# Altium schematic sheet [4]_SCH_input.SchDoc
size A
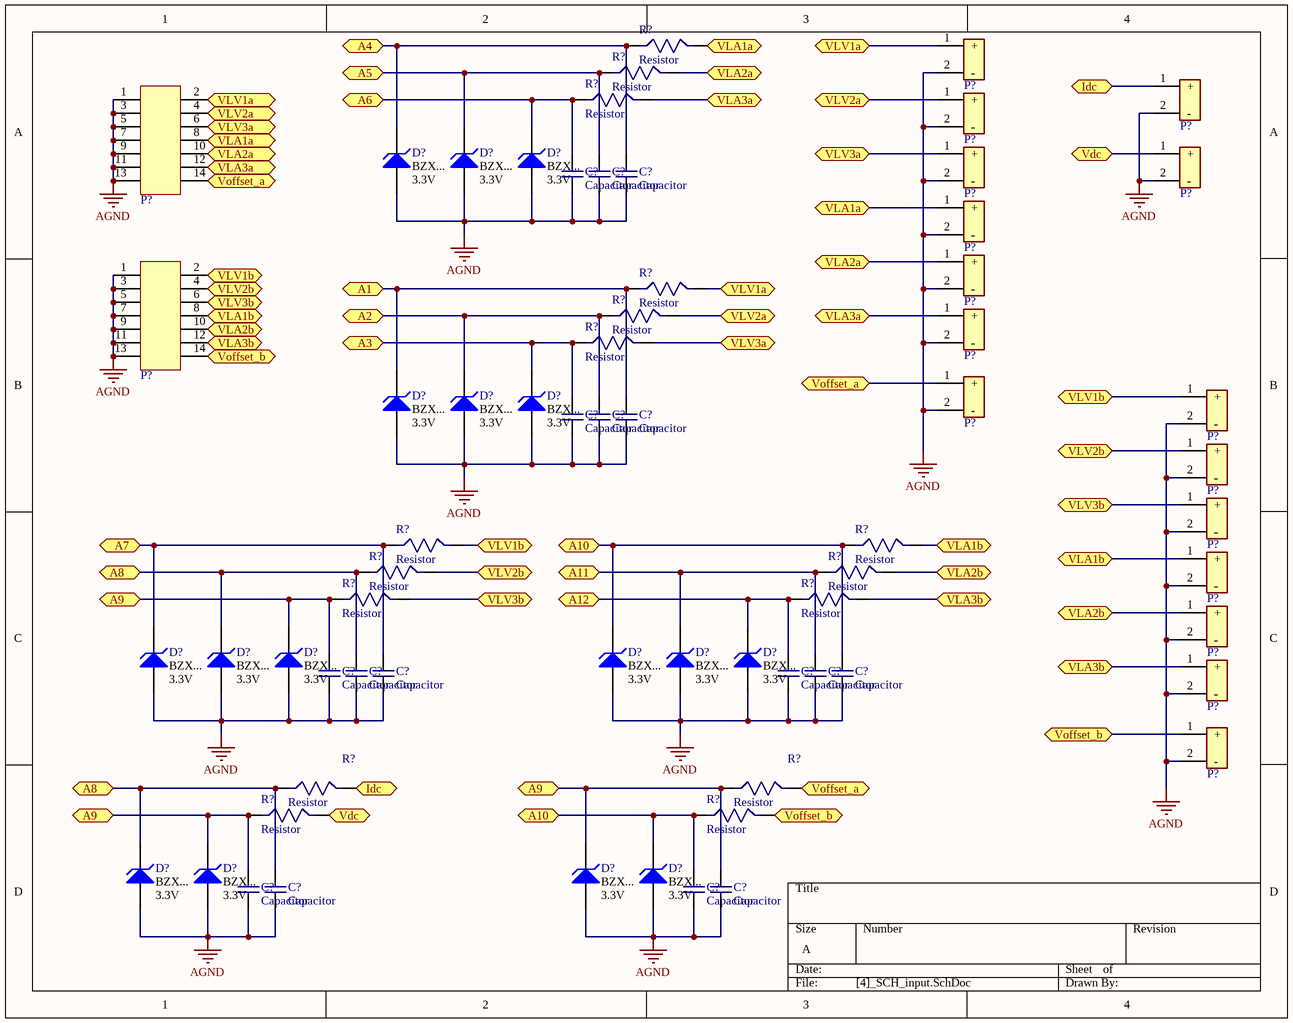
[diagram p0: [4]_SCH_input.SchDoc]

## Parts
(Parts that share a designator on the sheet are numbered #1, #2 ... from top to bottom, then left to right.)
C?#1  Capacitor  [C-NP-0805]
C?#2  Capacitor  [C-NP-0805]
C?#3  Capacitor  [C-NP-0805]
C?#4  Capacitor  [C-NP-0805]
C?#5  Capacitor  [C-NP-0805]
C?#6  Capacitor  [C-NP-0805]
C?#7  Capacitor  [C-NP-0805]
C?#8  Capacitor  [C-NP-0805]
C?#9  Capacitor  [C-NP-0805]
C?#10  Capacitor  [C-NP-0805]
C?#11  Capacitor  [C-NP-0805]
C?#12  Capacitor  [C-NP-0805]
C?#13  Capacitor  [C-NP-0805]
C?#14  Capacitor  [C-NP-0805]
C?#15  Capacitor  [C-NP-0805]
C?#16  Capacitor  [C-NP-0805]
D?#1  value BZX...  Volt: 3.3V  [DO_123]  (hidden comment: Diode Zener)
D?#2  value BZX...  Volt: 3.3V  [DO_123]  (hidden comment: Diode Zener)
D?#3  value BZX...  Volt: 3.3V  [DO_123]  (hidden comment: Diode Zener)
D?#4  value BZX...  Volt: 3.3V  [DO_123]  (hidden comment: Diode Zener)
D?#5  value BZX...  Volt: 3.3V  [DO_123]  (hidden comment: Diode Zener)
D?#6  value BZX...  Volt: 3.3V  [DO_123]  (hidden comment: Diode Zener)
D?#7  value BZX...  Volt: 3.3V  [DO_123]  (hidden comment: Diode Zener)
D?#8  value BZX...  Volt: 3.3V  [DO_123]  (hidden comment: Diode Zener)
D?#9  value BZX...  Volt: 3.3V  [DO_123]  (hidden comment: Diode Zener)
D?#10  value BZX...  Volt: 3.3V  [DO_123]  (hidden comment: Diode Zener)
D?#11  value BZX...  Volt: 3.3V  [DO_123]  (hidden comment: Diode Zener)
D?#12  value BZX...  Volt: 3.3V  [DO_123]  (hidden comment: Diode Zener)
D?#13  value BZX...  Volt: 3.3V  [DO_123]  (hidden comment: Diode Zener)
D?#14  value BZX...  Volt: 3.3V  [DO_123]  (hidden comment: Diode Zener)
D?#15  value BZX...  Volt: 3.3V  [DO_123]  (hidden comment: Diode Zener)
D?#16  value BZX...  Volt: 3.3V  [DO_123]  (hidden comment: Diode Zener)
P?#1  SMA  [SMA]  (value not drawn)
P?#2  SMA  [SMA]  (value not drawn)
P?#3  header_2x7  [hd_2x7]  (value not drawn)
P?#4  SMA  [SMA]  (value not drawn)
P?#5  SMA  [SMA]  (value not drawn)
P?#6  SMA  [SMA]  (value not drawn)
P?#7  SMA  [SMA]  (value not drawn)
P?#8  SMA  [SMA]  (value not drawn)
P?#9  header_2x7  [hd_2x7]  (value not drawn)
P?#10  SMA  [SMA]  (value not drawn)
P?#11  SMA  [SMA]  (value not drawn)
P?#12  SMA  [SMA]  (value not drawn)
P?#13  SMA  [SMA]  (value not drawn)
P?#14  SMA  [SMA]  (value not drawn)
P?#15  SMA  [SMA]  (value not drawn)
P?#16  SMA  [SMA]  (value not drawn)
P?#17  SMA  [SMA]  (value not drawn)
P?#18  SMA  [SMA]  (value not drawn)
R?#1  Resistor  [RESC0805]
R?#2  Resistor  [RESC0805]
R?#3  Resistor  [RESC0805]
R?#4  Resistor  [RESC0805]
R?#5  Resistor  [RESC0805]
R?#6  Resistor  [RESC0805]
R?#7  Resistor  [RESC0805]
R?#8  Resistor  [RESC0805]
R?#9  Resistor  [RESC0805]
R?#10  Resistor  [RESC0805]
R?#11  Resistor  [RESC0805]
R?#12  Resistor  [RESC0805]
R?#13  Resistor  [RESC0805]
R?#14  Resistor  [RESC0805]
R?#15  Resistor  [RESC0805]
R?#16  Resistor  [RESC0805]

## Ports
A1, A2, A3, A4, A5, A6, A7, A8, A9, A10, A11, A12, Idc, Vdc, VLA1a, VLA1b, VLA2a, VLA2b, VLA3a, VLA3b, VLV1a, VLV1b, VLV2a, VLV2b, VLV3a, VLV3b, Voffset_a, Voffset_b

## Nets
AGND: C?#1.1 C?#2.1 C?#3.1 C?#4.1 C?#5.1 C?#6.1 C?#7.1 C?#8.1 C?#9.1 C?#10.1 C?#11.1 C?#12.1 C?#13.1 C?#14.1 C?#15.1 C?#16.1 D?#1.1(A) D?#2.1(A) D?#3.1(A) D?#4.1(A) D?#5.1(A) D?#6.1(A) D?#7.1(A) D?#8.1(A) D?#9.1(A) D?#10.1(A) D?#11.1(A) D?#12.1(A) D?#13.1(A) D?#14.1(A) D?#15.1(A) D?#16.1(A) P?#1.2(-) P?#2.2(-) P?#3.1 P?#3.3 P?#3.5 P?#3.7 P?#3.9 P?#3.11 P?#3.13 P?#4.2(-) P?#5.2(-) P?#6.2(-) P?#7.2(-) P?#8.2(-) P?#9.1 P?#9.3 P?#9.5 P?#9.7 P?#9.9 P?#9.11 P?#9.13 P?#10.2(-) P?#11.2(-) P?#12.2(-) P?#13.2(-) P?#14.2(-) P?#15.2(-) P?#16.2(-) P?#17.2(-) P?#18.2(-)
A1: C?#6.2 D?#4.2(K) R?#4.1 ; port A1
A2: C?#5.2 D?#5.2(K) R?#5.1 ; port A2
A3: C?#4.2 D?#6.2(K) R?#6.1 ; port A3
A4: C?#3.2 D?#1.2(K) R?#1.1 ; port A4
A5: C?#2.2 D?#2.2(K) R?#2.1 ; port A5
A6: C?#1.2 D?#3.2(K) R?#3.1 ; port A6
A7: C?#9.2 D?#7.2(K) R?#7.1 ; port A7
A8: C?#8.2 C?#14.2 D?#8.2(K) D?#13.2(K) R?#9.1 R?#13.1 ; port A8
A9: C?#7.2 C?#13.2 C?#16.2 D?#9.2(K) D?#14.2(K) D?#15.2(K) R?#11.1 R?#14.1 R?#15.1 ; port A9
A10: C?#12.2 C?#15.2 D?#10.2(K) D?#16.2(K) R?#8.1 R?#16.1 ; port A10
A11: C?#11.2 D?#11.2(K) R?#10.1 ; port A11
A12: C?#10.2 D?#12.2(K) R?#12.1 ; port A12
Idc: P?#2.1(+) R?#13.2 ; port Idc
Vdc: P?#6.1(+) R?#15.2 ; port Vdc
VLA1a: P?#3.8 P?#7.1(+) R?#1.2 ; port VLA1a
VLA1b: P?#9.8 P?#15.1(+) R?#8.2 ; port VLA1b
VLA2a: P?#3.10 P?#8.1(+) R?#2.2 ; port VLA2a
VLA2b: P?#9.10 P?#16.1(+) R?#10.2 ; port VLA2b
VLA3a: P?#3.12 P?#10.1(+) R?#3.2 ; port VLA3a
VLA3b: P?#9.12 P?#17.1(+) R?#12.2 ; port VLA3b
VLV1a: P?#1.1(+) P?#3.2 R?#4.2 ; port VLV1a
VLV1b: P?#9.2 P?#12.1(+) R?#7.2 ; port VLV1b
VLV2a: P?#3.4 P?#4.1(+) R?#5.2 ; port VLV2a
VLV2b: P?#9.4 P?#13.1(+) R?#9.2 ; port VLV2b
VLV3a: P?#3.6 P?#5.1(+) R?#6.2 ; port VLV3a
VLV3b: P?#9.6 P?#14.1(+) R?#11.2 ; port VLV3b
Voffset_a: P?#3.14 P?#11.1(+) R?#14.2 ; port Voffset_a
Voffset_b: P?#9.14 P?#18.1(+) R?#16.2 ; port Voffset_b

## Library data of the parts
C?#1-C?#16 = capacitor_non_polar: capacitor non polar
D?#1-D?#16 = Diode Zener: Zener Diode; Vendor: Digikey; Published: 8-Jun-2000; LatestRevisionDate: 17-Jul-2002; LatestRevisionNote: Re-released for DXP Platform.; PackageReference: DIODE-0.7; Publisher: Altium Limited; ComponentLink1Description: Digikey Part Link; ComponentLink2Description: Open Datasheet; ComponentLink2URL: H:\LIBRARY\LIBRARY.Datasheet\
P?#1 P?#2 P?#4-P?#8 P?#10-P?#18 = SMA 13,5
P?#3 P?#9 = header_2x7pin